# Altium schematic sheet Microcontroller.SchDoc
size A4
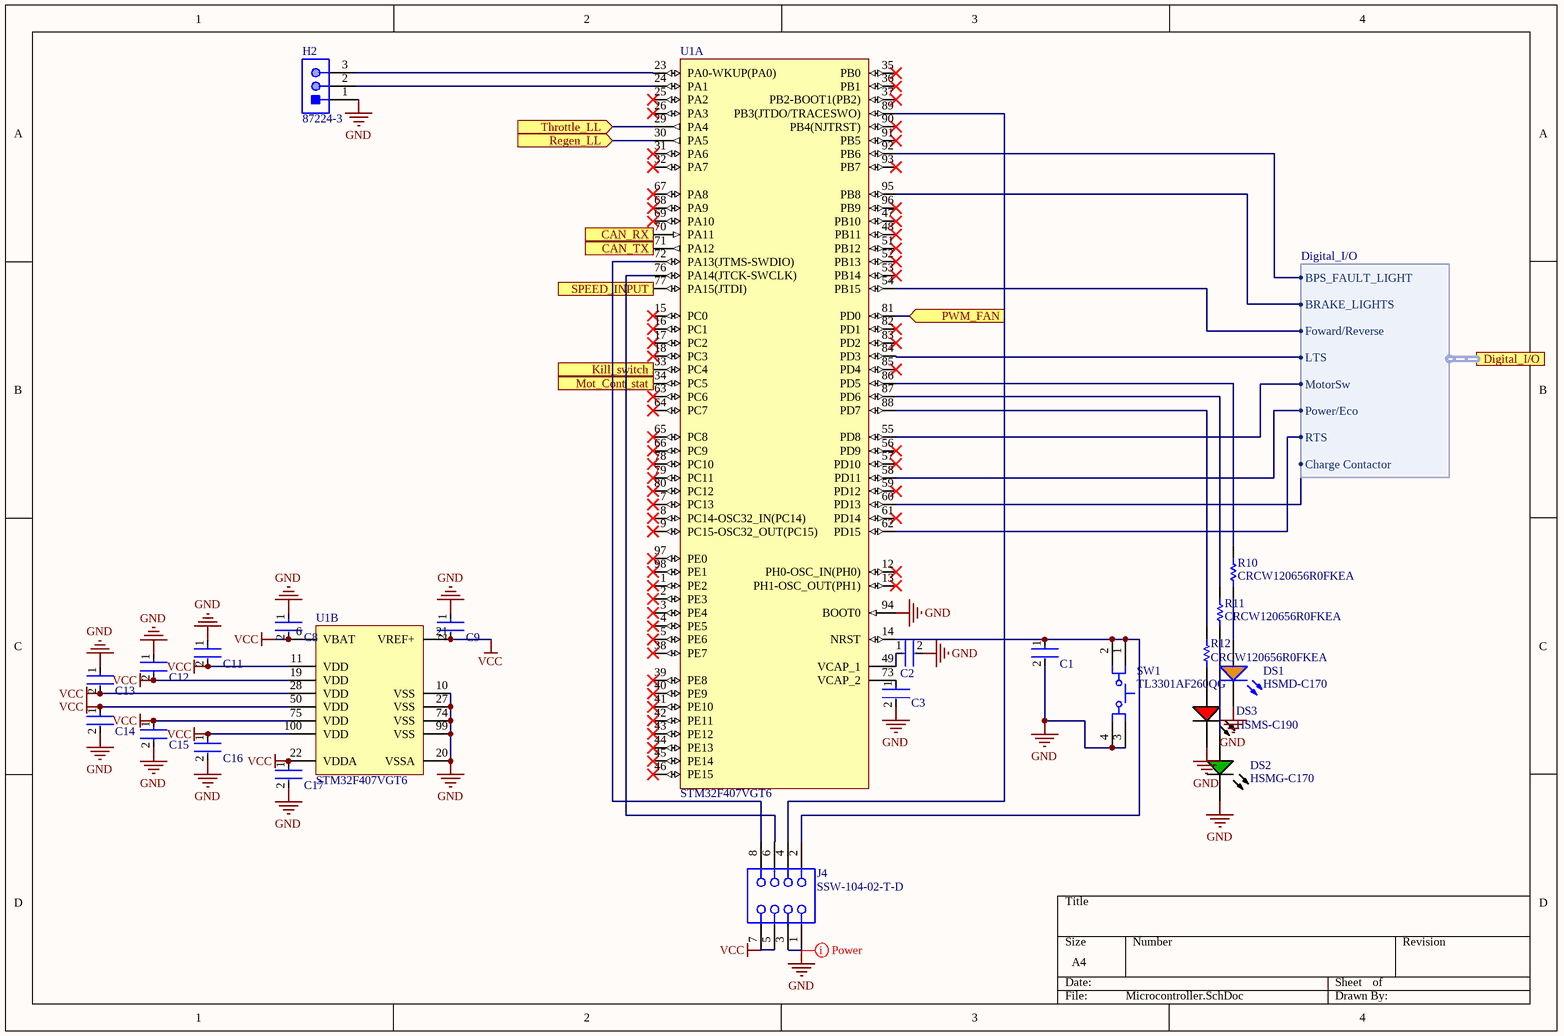
[diagram p0: Microcontroller.SchDoc]

## Parts
C1  C0603C104K5RACTU  [Kemet_C0603_IPC_A]  (value not drawn)
C2  CC0805KKX7R6BB225  (value not drawn)
C3  CC0805KKX7R6BB225  (value not drawn)
C8  C0603C104K5RACTU  [Kemet_C0603_IPC_A]  (value not drawn)
C9  C0603C104K5RACTU  [Kemet_C0603_IPC_A]  (value not drawn)
C11  C0603C104K5RACTU  [Kemet_C0603_IPC_A]  (value not drawn)
C12  C0603C104K5RACTU  [Kemet_C0603_IPC_A]  (value not drawn)
C13  C0603C104K5RACTU  [Kemet_C0603_IPC_A]  (value not drawn)
C14  C0603C104K5RACTU  [Kemet_C0603_IPC_A]  (value not drawn)
C15  C0603C104K5RACTU  [Kemet_C0603_IPC_A]  (value not drawn)
C16  C0603C104K5RACTU  [Kemet_C0603_IPC_A]  (value not drawn)
C17  C0603C104K5RACTU  [Kemet_C0603_IPC_A]  (value not drawn)
DS1  HSMD-C170  [AVAG-HSMX-C170_V]
DS2  HSMG-C170  [AVAG-HSMX-C170_V]
DS3  HSMS-C190  [AVAG-HSMX-C190_V]
H2  87224-3  [TECO-87224-3_V]
J4  SSW-104-02-T-D  [SMTC-SSW-104-02-X-D]
R10  CRCW120656R0FKEA  [RESC3216X60X45LL10T20]
R11  CRCW120656R0FKEA  [RESC3216X60X45LL10T20]
R12  CRCW120656R0FKEA  [RESC3216X60X45LL10T20]
SW1  TL3301AF260QG  [ESWI-TL3301AF260QG_V]
U1  STM32F407VGT6  [STM-LQFP100_M]  (parts A,B of 2)

## Ports
CAN_RX (in), CAN_TX (out), Digital_I/O (harness Digital_I/O), Kill_switch (out), Mot_Cont_stat (out), PWM_FAN (in), Regen_LL (in), SPEED_INPUT (out), Throttle_LL (in)

## Harnesses
Digital_I/O: BPS_FAULT_LIGHT, BRAKE_LIGHTS, Foward/Reverse, LTS, MotorSw, Power/Eco, RTS, Charge Contactor

## Nets
GND: C1.2 C2.2 C3.2 C8.1 C9.1 C11.1 C12.1 C13.1 C14.2 C15.2 C16.2 C17.2 DS1.2(K) DS2.2(K) DS3.2(K) H2.1 J4.1 J4.3 SW1.3 SW1.4 U1.10(VSS) U1.20(VSSA) U1.27(VSS) U1.74(VSS) U1.94(BOOT0) U1.99(VSS)
VCC: C8.2 C9.2 C11.2 C12.2 C13.2 C14.1 C15.1 C16.1 C17.1 J4.5 J4.7 U1.6(VBAT) U1.11(VDD) U1.19(VDD) U1.21(VREF+) U1.22(VDDA) U1.28(VDD) U1.50(VDD) U1.75(VDD) U1.100(VDD)
CAN_RX: U1.70(PA11) ; port CAN_RX
CAN_TX: U1.71(PA12) ; port CAN_TX
Kill_switch: U1.33(PC4) ; port Kill_switch
Mot_Cont_stat: U1.34(PC5) ; port Mot_Cont_stat
PWM_FAN: U1.81(PD0) ; port PWM_FAN
Regen_LL: U1.30(PA5) ; port Regen_LL
SPEED_INPUT: U1.77(PA15(JTDI)) ; port SPEED_INPUT
Throttle_LL: U1.29(PA4) ; port Throttle_LL
NetC1_1: C1.1 J4.2 SW1.1 SW1.2 U1.14(NRST)
NetC2_1: C2.1 U1.49(VCAP_1)
NetC3_1: C3.1 U1.73(VCAP_2)
NetDS1_1: DS1.1(A) R10.1
NetDS2_1: DS2.1(A) R11.1
NetDS3_1: DS3.1(A) R12.1
NetH2_2: H2.2 U1.24(PA1)
NetH2_3: H2.3 U1.23(PA0-WKUP(PA0))
NetJ4_4: J4.4 U1.89(PB3(JTDO/TRACESWO))
NetJ4_6: J4.6 U1.76(PA14(JTCK-SWCLK))
NetJ4_8: J4.8 U1.72(PA13(JTMS-SWDIO))
NetR10_2: R10.2 U1.86(PD5)
NetR11_2: R11.2 U1.87(PD6)
NetR12_2: R12.2 U1.88(PD7)
NetU1_54: U1.54(PB15) ; port Digital_I/O.Foward/Reverse
NetU1_55: U1.55(PD8) ; port Digital_I/O.MotorSw
NetU1_58: U1.58(PD11) ; port Digital_I/O.Power/Eco
NetU1_60: U1.60(PD13) ; port Digital_I/O.Charge Contactor
NetU1_62: U1.62(PD15) ; port Digital_I/O.RTS
NetU1_84: U1.84(PD3) ; port Digital_I/O.LTS
NetU1_92: U1.92(PB6) ; port Digital_I/O.BPS_FAULT_LIGHT
NetU1_95: U1.95(PB8) ; port Digital_I/O.BRAKE_LIGHTS

Not connected (* = marked no-connect by the designer): U1 1(PE2)* 2(PE3)* 3(PE4)* 4(PE5)* 5(PE6)* 7(PC13)* 8(PC14-OSC32_IN(PC14))* 9(PC15-OSC32_OUT(PC15))* 12(PH0-OSC_IN(PH0))* 13(PH1-OSC_OUT(PH1))* 15(PC0)* 16(PC1)* 17(PC2)* 18(PC3)* 25(PA2)* 26(PA3)* 31(PA6)* 32(PA7)* 35(PB0)* 36(PB1)* 37(PB2-BOOT1(PB2))* 38(PE7)* 39(PE8)* 40(PE9)* 41(PE10)* 42(PE11)* 43(PE12)* 44(PE13)* 45(PE14)* 46(PE15)* 47(PB10)* 48(PB11)* 51(PB12)* 52(PB13)* 53(PB14)* 56(PD9)* 57(PD10)* 59(PD12)* 61(PD14)* 63(PC6)* 64(PC7)* 65(PC8)* 66(PC9)* 67(PA8)* 68(PA9)* 69(PA10)* 78(PC10)* 79(PC11)* 80(PC12)* 82(PD1)* 83(PD2)* 85(PD4)* 90(PB4(NJTRST))* 91(PB5)* 93(PB7)* 96(PB9)* 97(PE0)* 98(PE1)*

## Layout directives
net class Power: GND

## Library data of the parts
C2 C3 = CC0805KKX7R6BB225: 2.2UF
DS1 = CMP-2000-06421-1: LED Uni-Color Orange, 52 mW, 20 mA, -40 to 85 degC, 2-Pin SMD, RoHS, Tape and Reel; Manufacturer: Avago; Forward Current If Max: 20mA; External Length / Height: 2mm; Luminous Intensity: 8mcd; Lens Shape: Rectangular; Bulb Size: 1.25mmx1.4mm; External Width: 1.25mm; Wavelength Typ: 605nm; Dominant Wavelength: 604nm; PIV Max: 5V; Opto Mounting Orientation: Top; Viewing Angle: 170°; LED Type: Standard; Forward Voltage: 2.2V; SVHC: NoSVHC(19-Dec-2012); No. of Pins: 2; External Depth: 0.8mm; Power Dissipation Pd: 52mW; Storage Temperature Max: 85°C; Package Description: 2-Pin Surface Mount Device, Body 2 x 1.25 mm, Height 0.8 mm; MSL: MSL2A-4weeks; Operating Temperature Range: -30°Cto+85°C; Datasheet URL: http://docs.avagotech.com/docs/AV02-0551EN; Manufacturer URL: http://www.avagotech.com/; Operating Temperature Min: -30°C; Light Area Height: 1.25mm; Mounting Technology: SurfaceMount; Storage Temperature Min: -40°C; LED Mounting: SMD; Peak Wavelength: 605nm; Package / Case: SMD; Peak Forward Current: 20mA; Forward Voltage VF Max: 2.2V; Mounting Type: SMD; LED Colour: Orange; Forward Current If: 20mA; Operating Temperature Max: 85°C; Voltage Vf Typ: 2.2V; Package Reference: HSMX-C170; Datasheet Version: 03/2012; Opto Case Style: SMD; Luminous Intensity Typ: 8mcd
DS2 = CMP-2000-05062-1: Chip LED, Green, 2.2 V, -40 to 85 degC, 2-Pin SMD, Pb-Free, Tape and Reel; Manufacturer: Avago; No. of Pins: 2; Peak Wavelength: 570nm; SVHC: NoSVHC(16-Jun-2014); Dominant Wavelength: 572nm; Forward Current If: 20mA; Viewing Angle: 170deg; Lens Shape: Rectangular; PIV Max: 5V; External Width: 1.25mm; LED Type: Standard; External Depth: 0.8mm; Opto Mounting Orientation: Top; Luminous Intensity: 15mcd; Luminous Intensity Min: 4mcd; Forward Voltage VF Max: 2.6V; External Length / Height: 2mm; Bulb Size: 1.25mmx1.4mm; Light Area Height: 1mm; Voltage Vf Typ: 2.2V; Operating Temperature Max: 85degC; Datasheet Version: Oct-08; MSL: MSL2A-4weeks; Peak Forward Current: 20mA; Package Description: 2-Pin Surface Mount Device, Body 2 x 1.25 mm, Height 0.8 mm; Datasheet URL: https://datasheet.ciiva.com/29280/180495-da-01-en-chip-led-hsmg-c170-gelb-gruen-29280971.pdf; Storage Temperature Min: -40degC; LED Colour: Green; Wavelength Typ: 570nm; Mounting Type: SMD; Forward Current If Max: 20mA; Dominant Wavelength Typ: 572nm; LED Mounting: SMD; Operating Temperature Range: -30degCto+85degC; Operating Temperature Min: -30degC; Manufacturer URL: http://www.avagotech.com/; Packaging: CutTape; Luminous Intensity Typ: 15mcd; Package Reference: HSMX-C170; Storage Temperature Max: 85degC; Opto Case Style: SMD; Forward Voltage: 2.2V
DS3 = CMP-2000-06427-1: LED Uni-Color Red, 52 mW, 20 mA, -40 to 85 degC, 2-Pin SMD, RoHS, Tape and Reel; Manufacturer: Avago; Reverse Voltage: 5V; Viewing Angle: 170deg; High Brightness: No; Lens Type: ColorlessDiffused; DELETED: Compliant; Product Height (mm): 0.8mm; Dominant Wave Length: 626nm; Number of  Elements: 1; Chip Material: GaP; Lum Intensity: 10mcd; Product Length (mm): 1.6mm; Forward Voltage: 2.6V; Power Dissipation: 52W; Shape Type: Rectangular; Forward Current: 25mA; Peak Wavelength: 630nm; Test Current (It): 20mA; Main Category: ChipLED; Lens Dimensions: 1x0.8x0.5mm; Pin Count: 2; Package Reference: HSMX-C190; Mounting Technology: SurfaceMount; Mounting: SurfaceMount; Datasheet URL: http://docs.avagotech.com/docs/AV02-0551EN; Package Type: ChipLed; Operating Temperature Classification: Industrial; Datasheet Version: 03/2012; Operating Temp Range: -40Cto85C; Emitting Color: Red; Rad Hardened: No; Manufacturer URL: http://www.avagotech.com/; Luminous Intensity: 10mcd; Package Description: 2-Pin Surface Mount Device, Body 1.6 x 0.8 mm, Height 0.9 mm; Type: Uni-Color; Packaging: TapeandReel; Product Depth (mm): 0.8mm
H2 = CMP-2000-05697-1: Male Header, Pitch 2.54 mm, 1 x 3 Position, Height 10.744 mm, Tail Length 3.175 mm, -65 to 105 degC, RoHS, Bulk; Manufacturer: TE Connectivity; Catalog Drawings: SingleSquareStraightPost / SingleSquareStraightPostSide; Connector Type: Header,Unshrouded; Pitch: 0.100"(2.54mm); Mating Products: 147738-2-ND / -CONNRCPT3POSVERTSMDGOLD / 147723-2-ND / -CONNRCPT3POSVERT.100GOLD / 146763-5-ND / -CONNRCPT3POSSGLVERT.100T/H / A32904-ND / -CONNRECEPT3POS.100VERTGOLD / A26922-ND / -CONNHOUSING3POS.100LOCKING / A26415-ND / -CONNRECEPT3POS.100VERTAU / A26964-ND / -CONNHOUSING3POS.100SINGLE / A3012-ND / -CONNHOUSING3POS.100SINGLE; Number of Positions Loaded: All; Featured Product: AMPMODUConnectors; Dynamic Catalog: AMPMODUModIISeries; 3D Model: 87224-3.pdf; Other Names: 87224-3-ND / A26545; Number of Positions: 3; RoHS Information: 87224-3StatementofCompliance; Termination: Solder; Datasheet URL: http://www.te.com/commerce/DocumentDelivery/DDEController?Action=showdoc&DocId=Customer+Drawing%7F87224%7FL3%7Fpdf%7FEnglish%7FENG_CD_87224_L3.pdf%7F87224-3; Category: Connectors,Interconnects; Contact Mating Length: 0.318"(8.08mm); Standard Package: 520; Mounting Type: ThroughHole; Family: RectangularConnectors-Headers,MalePins; Number of Rows: 1; Series: AMPMODUModII; Contact Finish Thickness: 15µin(0.38µm); Datasheet Version: Rev. L3, 08/2015; Package Reference: 87224-3; Mounting Technology: ThroughHole; Manufacturer URL: http://www.te.com/; Contact Type: MalePin; Packaging: Bulk; Color: Black; Package Description: Male Header, Pitch 2.54 mm, 1 x 3 Position, Height 10.744 mm, Tail Length 3.175 mm; Contact Finish: Gold
J4 = CMP-1023-00342-1: SQ Post Socket, Through-hole, Vertical, -55 to 105 degC, 2.54mm Pitch, 8-Pin, Female, RoHS; Manufacturer: Samtec; Mounting Technology: Through-hole; ComponentLink3Description: Package Specification; ComponentLink3URL: http://www.samtec.com/documents/webfiles/cpdf/SSW-1XX-XX-XXX-X-XX-XXX-XX-MKT.pdf; Temperature Range: -55 to 105 degC; DatasheetVersion: F-214; PackageVersion: CA, 6/1987; ComponentLink1URL: http://www.samtec.com; RoHS: True; Pitch: 2.54 mm; ComponentLink2Description: Datasheet; ComponentLink2URL: http://www.samtec.com/documents/webfiles/pdf/SSW_TH.PDF; PackageDescription: Assembly, Socket Strip .016 X .031 Tail; PackageReference: SSW-104-02-X-D; ComponentLink1Description: Manufacturer URL; PartNumber: SSW-104-02-T-D; Orientation: Vertical
R10-R12 = CMP-2003-02285-1: Manufacturer: Vishay Dale; Part Number: CRCW120656R0FKEA
SW1 = CMP-2000-07249-1: Tactile Switch, SPST-NO, 50 mA, 12 V, -20 to 70 degC, 4-Pin SMD, RoHS, Tape and Reel; Manufacturer: E-Switch; Catalog Drawings: TL3301xFFootprint; Contact Rating @ Voltage: 0.05A@12VDC; Featured Product: TL3301SeriesTactSwitch; Mechanical Life: 100,000Cycles; Product Training Modules: SwitchBasics; Actuator Orientation: TopActuated; Switch Travel: 0.25mm; Other Names: EG2527DKR; 3D Model: TL3301AFyyyyG.stp; Illumination: Non-Illuminated; Switch Function: Off-Mom; Online Catalog: TL3301Series; Outline: 6.00mmx6.00mm; Package Version: Rev. D, 10/2014; Operating Force: 260gf; Actuator Material: Polyamide(PA),Nylon; Actuator Type: Standard; Actuator Height off PCB, from Pins: 5.00mm; Packaging: Digi-Reel®; Standard Package: 1; Datasheet URL: https://www.e-switch.com/system/asset/product_line/data_sheet/185/TL3301.pdf; Family: TactileSwitches; Mounting Technology: SurfaceMount; Illumination Type, Color: -; Manufacturer URL: http://www.e-switch.ch/en/; RoHS Information: TL3301SeriesRoHSCertofCompliance; Ingress Protection: -; Package URL: http://spec_sheets.e-switch.com/specs/P010513.pdf; Illumination Voltage (Nominal): -; Operating Temperature: -20°C~70°C; Series: TL3301; Termination Style: GullWing; Category: Switches; Mounting Type: SurfaceMount; Package Description: 4-Pin Surface Mount Device, Body 6 x 6 mm; Features: -; Circuit: SPST-NO; Package Reference: TL3301AF260QG; Datasheet Version: 12/2013
U1 = CMP-0243-00017-3: ARM Cortex-M4 32-bit MCU+FPU, 210 DMIPS, 1024 kB Flash, 192 kB Internal RAM, 82 I/Os, 100-pin LQFP, -40 to 85 degC, Tray; Manufacturer: STMicroelectronics; Supply Voltage(Vcc) min (V): 1.8; Supply Voltage(Vcc) max (V): 3.6; I/Os (High Current): 82; Operating Frequency(F) (Processor speed) (MHz): 168; D/A Converter: 2x12-bit; FLASH Size (Prog) (kB): 1024; Internal RAM Size (kB): 192; PackageDescription: 100-Pin Low Profile Quad Flat Package, 14 x 14 mm Body, 0.5 mm Pitch; ComponentLink3URL: http://www.st.com/st-web-ui/static/active/en/resource/technical/document/data_brief/DM00071938.pdf; PackageVersion: Rev. 1, 06/2013; PackageReference: LQFP100; PartNumber: STM32F407VGT6; ComponentLink1Description: Manufacturer URL; ComponentLink2URL: http://www.st.com/st-web-ui/static/active/en/resource/technical/document/datasheet/DM00037051.pdf; DatasheetVersion: Rev. 4; ComponentLink3Description: Package Specification; Core: ARM Cortex-M4; ComponentLink2Description: Datasheet; Mounting Technology: Surface Mount; ComponentLink1URL: http://www.st.com/web/en/home.html; Packing: Tray